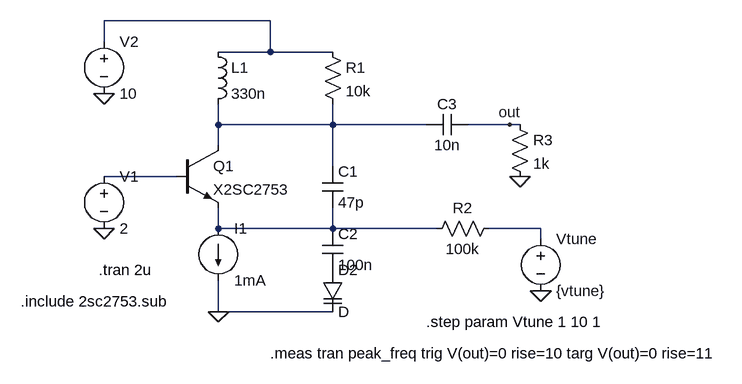
[diagram p0: schematic narrowband.asc]
narrowband.asc, the LTspice schematic file:
Version 4
SHEET 1 1396 852
WIRE 336 32 80 32
WIRE 80 64 80 32
WIRE 336 80 336 32
WIRE 336 80 256 80
WIRE 432 80 336 80
WIRE 256 192 256 160
WIRE 432 192 432 160
WIRE 432 192 256 192
WIRE 576 192 432 192
WIRE 704 192 640 192
WIRE 720 192 704 192
WIRE 256 224 256 192
WIRE 432 256 432 192
WIRE 192 272 80 272
WIRE 256 352 256 320
WIRE 432 352 432 320
WIRE 432 352 256 352
WIRE 592 352 432 352
WIRE 752 352 672 352
WIRE 752 368 752 352
WIRE 256 480 256 432
WIRE 432 480 256 480
FLAG 80 144 0
FLAG 80 352 0
FLAG 256 480 0
FLAG 752 448 0
FLAG 704 192 out
FLAG 720 272 0
SYMBOL npn 192 224 R0
SYMATTR InstName Q1
SYMATTR Value X2SC2753
SYMATTR Prefix X1
SYMBOL Cap 416 256 R0
SYMATTR InstName C1
SYMATTR Value 47p
SYMBOL Res 416 64 R0
SYMATTR InstName R1
SYMATTR Value 10k
SYMBOL ind 240 64 R0
SYMATTR InstName L1
SYMATTR Value 330n
SYMBOL current 256 352 R0
SYMATTR InstName I1
SYMATTR Value 1mA
SYMBOL voltage 80 256 R0
SYMATTR InstName V1
SYMATTR Value 2
SYMBOL voltage 80 48 R0
SYMATTR InstName V2
SYMATTR Value 10
SYMBOL varactor 416 416 R0
SYMATTR InstName D2
SYMBOL Cap 416 352 R0
SYMATTR InstName C2
SYMATTR Value 100n
SYMBOL Res 688 336 R90
WINDOW 0 0 56 VBottom 2
WINDOW 3 32 56 VTop 2
SYMATTR InstName R2
SYMATTR Value 100k
SYMBOL voltage 752 352 R0
SYMATTR InstName Vtune
SYMATTR Value {vtune}
SYMBOL Cap 640 176 R90
WINDOW 0 0 32 VBottom 2
WINDOW 3 32 32 VTop 2
SYMATTR InstName C3
SYMATTR Value 10n
SYMBOL Res 704 176 R0
SYMATTR InstName R3
SYMATTR Value 1k
TEXT 72 416 Left 2 !.tran 2u
TEXT -48 464 Left 2 !.include 2sc2753.sub
TEXT 576 496 Left 2 !.step param Vtune 1 10 1
TEXT 336 544 Left 2 !.meas tran peak_freq trig V(out)=0 rise=10 targ V(out)=0 rise=11

The netlist it stands for:
* narrowband.asc
XQ1 N002 N003 N004 X2SC2753  ; pins C B E
C1 N002 N004 47p
R1 N001 N002 10k
L1 N001 N002 330n
I1 N004 0 1mA
V1 N003 0 2
V2 N001 0 10
D2 P001 0 D
C2 N004 P001 100n
R2 N005 N004 100k
Vtune N005 0 {vtune}
C3 out N002 10n
R3 out 0 1k
.model D D
.lib standard.dio
.tran 2u
.include 2sc2753.sub
.step param Vtune 1 10 1
.meas tran peak_freq trig V(out)=0 rise=10 targ V(out)=0 rise=11
.backanno
.end